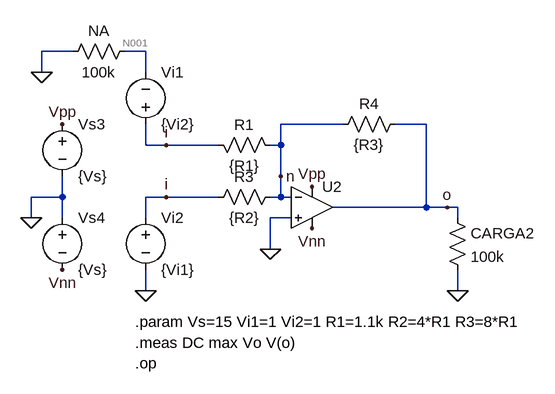
[diagram p0: schematic ex1c.asc]
ex1c.asc, the LTspice schematic file:
Version 4
SHEET 1 1528 680
WIRE 768 -112 720 -112
WIRE 880 -112 848 -112
WIRE 720 -80 720 -112
WIRE 880 -80 880 -112
WIRE 1184 0 1088 0
WIRE 1312 0 1264 0
WIRE 880 32 880 0
WIRE 912 32 880 32
WIRE 992 32 912 32
WIRE 1088 32 1088 0
WIRE 1088 32 1072 32
WIRE 1088 80 1088 32
WIRE 752 112 752 80
WIRE 752 112 704 112
WIRE 912 112 880 112
WIRE 992 112 912 112
WIRE 1088 112 1088 80
WIRE 1088 112 1072 112
WIRE 1104 112 1088 112
WIRE 1312 128 1312 0
WIRE 1312 128 1168 128
WIRE 1344 128 1312 128
WIRE 1360 128 1344 128
WIRE 704 144 704 112
WIRE 752 144 752 112
WIRE 880 144 880 112
WIRE 1104 144 1072 144
WIRE 1360 144 1360 128
WIRE 1072 192 1072 144
WIRE 880 256 880 224
WIRE 1360 256 1360 224
FLAG 1072 192 0
FLAG 880 256 0
FLAG 1360 256 0
FLAG 704 144 0
FLAG 752 0 Vpp
FLAG 752 224 Vnn
FLAG 1344 128 o
FLAG 912 112 i
FLAG 1136 96 Vpp
FLAG 1136 160 Vnn
FLAG 1088 80 n
FLAG 912 32 i
FLAG 720 -80 0
SYMBOL voltage 880 128 R0
SYMATTR InstName Vi2
SYMATTR Value {Vi1}
SYMBOL res 1088 96 R90
WINDOW 0 0 56 VBottom 2
WINDOW 3 32 56 VTop 2
SYMATTR InstName R3
SYMATTR Value {R2}
SYMBOL res 1280 -16 R90
WINDOW 0 0 56 VBottom 2
WINDOW 3 32 56 VTop 2
SYMATTR InstName R4
SYMATTR Value {R3}
SYMBOL OpAmps\\UniversalOpAmp2 1136 128 R0
SYMATTR InstName U2
SYMATTR Value2 Avol=125 GBW=10Meg Slew=10Meg
SYMBOL voltage 752 -16 R0
SYMATTR InstName Vs3
SYMATTR Value {Vs}
SYMBOL voltage 752 128 R0
SYMATTR InstName Vs4
SYMATTR Value {Vs}
SYMBOL res 1344 128 R0
SYMATTR InstName CARGA2
SYMATTR Value 100k
SYMBOL voltage 880 16 M180
WINDOW 0 24 96 Left 2
WINDOW 3 24 16 Left 2
SYMATTR InstName Vi1
SYMATTR Value {Vi2}
SYMBOL res 1088 48 M270
WINDOW 0 32 56 VTop 2
WINDOW 3 0 56 VBottom 2
SYMATTR InstName R1
SYMATTR Value {R1}
SYMBOL res 864 -128 R90
WINDOW 0 0 56 VBottom 2
WINDOW 3 32 56 VTop 2
SYMATTR InstName NA
SYMATTR Value 100k
TEXT 864 304 Left 2 !.param Vs=15 Vi1=1 Vi2=1 R1=1.1k R2=4*R1 R3=8*R1
TEXT 864 368 Left 2 !.op
TEXT 864 336 Left 2 !.meas DC max Vo V(o)

The netlist it stands for:
* ex1c.asc
Vi2 i 0 {Vi1}
R3 n i {R2}
R4 o n {R3}
XU2 0 n Vpp Vnn o level2 Avol=125 GBW=10Meg Slew=10Meg Ilimit=25m Rail=0 Vos=0 En=0 Enk=0 In=0 Ink=0 Rin=500Meg  ; pins In+ In- V+ V- OUT
Vs3 Vpp 0 {Vs}
Vs4 0 Vnn {Vs}
R§CARGA2 o 0 100k
Vi1 i N001 {Vi2}
R1 n i {R1}
R§NA N001 0 100k
.param Vs=15 Vi1=1 Vi2=1 R1=1.1k R2=4*R1 R3=8*R1
.op
.meas DC max Vo V(o)
.lib UniversalOpAmp2.lib
.backanno
.end

* Results of the author's LTspice run, read from the files saved beside the schematic
* Operating Point:
*   V(i) = 1 V
*   V(n) = 79.21 mV
*   V(o) = -9.129 V
*   V(vpp) = 15 V
*   V(vnn) = -15 V
*   V(n001) = 0 V
*   I(R3) = -209.3 µA
*   I(R4) = -1.046 mA
*   I(Carga2) = -91.29 µA
*   I(R1) = -837.1 µA
*   I(Na) = 0 A
*   I(Vi2) = -1.046 mA
*   I(Vs3) = -749.3 µA
*   I(Vs4) = -1.887 mA
*   I(Vi1) = 0 A
*   Ix(u2:1) = 0 A
*   Ix(u2:2) = 158.4 pA
*   Ix(u2:3) = 749.3 µA
*   Ix(u2:4) = -1.887 mA
*   Ix(u2:5) = 1.138 mA
* From the log:
*   Semiconductor Device Operating Points:
*                           --- Diodes ---
*   Name:    d:u2:1      d:u2:2
*   Model:    u2:x        u2:x
*   Id:     -2.42e-11   -5.88e-12
*   Vd:     -2.41e+01   -5.87e+00
*   Req:     1.00e-12    1.00e-12
*   CAP:     0.00e+00    0.00e+00